# Altium schematic sheet power_mgmt.SchDoc (part 1 of 2)
size A4; SheetNumber: 6; SheetTotal: 8
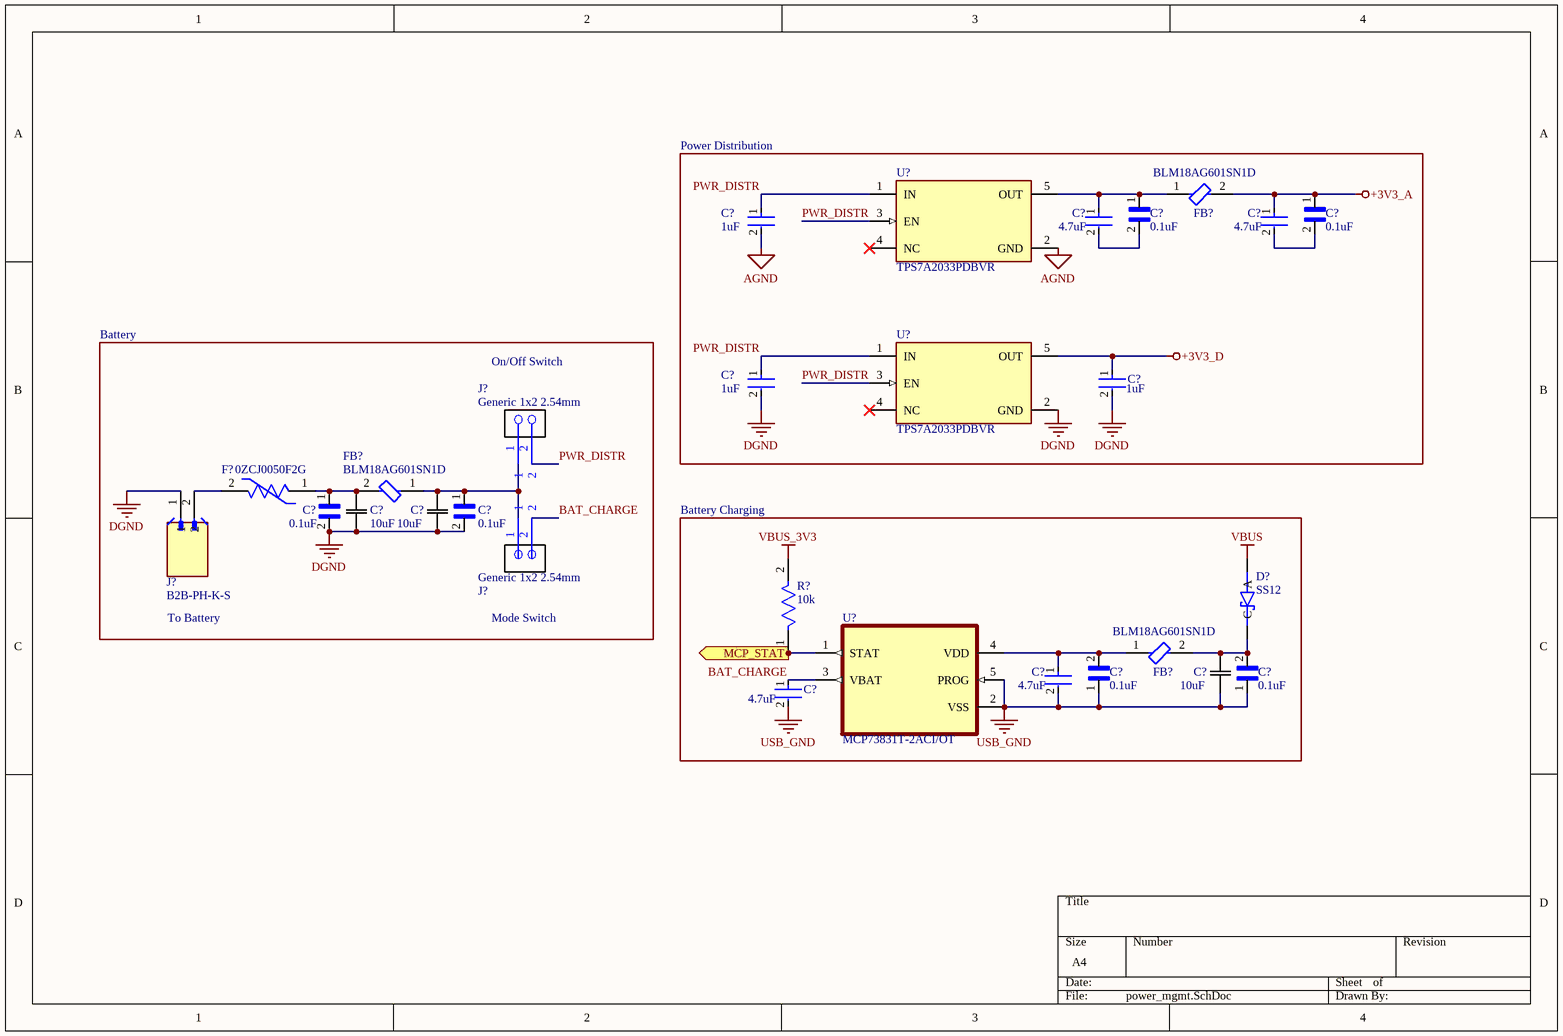
[diagram p0: power_mgmt.SchDoc]

## Parts
(Parts that share a designator on the sheet are numbered #1, #2 ... from top to bottom, then left to right.)
C?#1  1uF  [CC0805KKX7R7BB106]
C?#2  4.7uF  [CC0805KKX7R7BB106]
C?#3  4.7uF  [CC0805KKX7R7BB106]
C?#4  0.1uF  [CC0603JRX7R8BB104]
C?#5  0.1uF  [CC0603JRX7R8BB104]
C?#6  1uF  [CC0805KKX7R7BB106]
C?#7  1uF  [CC0805KKX7R7BB106]
C?#8  0.1uF  [CC0603JRX7R8BB104]
C?#9  0.1uF  [CC0603JRX7R8BB104]
C?#10  10uF  [CC0805KKX7R7BB106]
C?#11  10uF  [CC0805KKX7R7BB106]
C?#12  10uF  [CC0805KKX7R7BB106]
C?#13  4.7uF  [CC0805KKX7R7BB106]
C?#14  0.1uF  [CC0603JRX7R8BB104]
C?#15  0.1uF  [CC0603JRX7R8BB104]
C?#16  4.7uF  [CC0805KKX7R7BB106]
D?  SS12  [DIOM4427X270N]
F?  0ZCJ0050F2G  [0ZCJ0050FF2G]
FB?#1  BLM18AG601SN1D  [BLM18AG601SN1D]
FB?#2  BLM18AG601SN1D  [BLM18AG601SN1D]
FB?#3  BLM18AG601SN1D  [BLM18AG601SN1D]
J?#1  Generic 1x2 2.54mm  [GENERIC 1X2 2.54mm]
J?#2  B2B-PH-K-S  [JST_B2B-PH-K-S]
J?#3  Generic 1x2 2.54mm  [GENERIC 1X2 2.54mm]
R?  10k  [RC0603FR-07]
U?#1  TPS7A2033PDBVR  [TPS7A2033PDBVR]
U?#2  TPS7A2033PDBVR  [TPS7A2033PDBVR]
U?#3  MCP73831T-2ACI/OT  [SOT95P280X145-5N]

## Blocks framed on the sheet
Power Distribution: C?#1-C?#7 FB?#1 U?#1 U?#2
Battery Charging: C?#12-C?#16 D? FB?#3 R? U?#3

## Ports
MCP_STAT (out)

## Nets
+3V3_A: C?#3.1 C?#5.1 FB?#1.2
+3V3_D: C?#7.1 U?#2.5(OUT)
AGND: C?#1.2 U?#1.2(GND)
DGND: C?#6.2 C?#7.2 C?#8.2 C?#9.2 C?#10.1 C?#11.1 J?#2.1 U?#2.2(GND)
USB_GND: C?#12.2 C?#13.2 C?#14.1 C?#15.1 C?#16.2 U?#3.2(VSS) U?#3.5(PROG)
VBUS: D?.A
VBUS_3V3: R?.2
BAT_CHARGE: C?#16.1 U?#3.3(VBAT)
MCP_STAT: R?.1 U?#3.1(STAT) ; port MCP_STAT
PWR_DISTR: C?#1.1 C?#6.1 U?#1.1(IN) U?#1.3(EN) U?#2.1(IN) U?#2.3(EN)
NetC?#2_1: C?#2.1 C?#4.1 FB?#1.1 U?#1.5(OUT)
NetC?#2_2: C?#2.2 C?#4.2
NetC?#3_2: C?#3.2 C?#5.2
NetC?#8_1: C?#8.1 C?#10.2 F?.1 FB?#2.2
NetC?#9_1: C?#9.1 C?#11.2 FB?#2.1
NetC?#12_1: C?#12.1 C?#15.2 D?.C FB?#3.2
NetC?#13_1: C?#13.1 C?#14.2 FB?#3.1 U?#3.4(VDD)
NetF?_2: F?.2 J?#2.2

Not connected (* = marked no-connect by the designer): J?#1 1 2; J?#3 1 2; U?#1 4(NC)*; U?#2 4(NC)*

## Notes on the sheet
- Battery
- On/Off Switch
- To Battery
- Mode Switch
## Library data of the parts
C?#1 C?#6 C?#7 = CC0805KKX7R7BB105: 16V 1uF X7R ±10% 0805 Multilayer Ceramic Capacitors MLCC - SMD/SMT ROHS; Manufacturer: Yageo Group; Manufacturer Package Identifier: CC0805-0.85; Value: 1µF; Supplier: DigiKey; Supplier Part Number: 311-1365-1-ND; Manufacturer Part Number: CC0805KKX7R7BB105; RoHS: Compliant; Category: Ceramic Capacitors; Stock: 898629; Pricing: 1=0.13, 10=0.072, 50=0.05, 100=0.0434, 500=0.0323, 1000=0.02889 (USD); Case/Package: 0805; Case Code (Imperial): 0805; Case Code (Metric): 2012; China RoHS: Compliant; Country of Origin: Mainland China, Taiwan; Depth: 1.25mm; Dielectric: X7R; Dielectric Material: Ceramic; Export Control Classification Number (ECCN) Code: EAR99; Halogen Free: Halogen Free; Height: 1.25mm; Harmonized Tariff Schedule (HTS) Code: 8532.24.00.20; Introduction Date: 2009-04-17; Lead Free: Lead Free; Length: 2mm; Lifecycle Status: Production; Material: Ceramic; Max Operating Temperature: 125°C; Min Operating Temperature: -55°C; Mounting Technology: Surface Mount; Pins: 2; Number of Terminals: 2; Radiation Hardening: No; REACH SVHC: Yes; Schedule B: 8532240020, 8532240020|8532240020|8532240020|8532240020|8532240020|8532240020|8532240020|8532240020|8532240020|8532240020|8532240020|8532240020, 8532240020|8532240020|8532240020|8532240020|8532240020|8532240020|8532240020|8532240020|8532240020|8532240020|8532240020|8532240020|8532240020, 8532240020|8532240020|8532240020|8532240020|8532240020|8532240020|8532240020|8532240020|8532240020|8532240020|8532240020|8532240020|8532240020|8532240020; Termination: SMD/SMT; Thickness: 1.2446mm; Tolerance: 10%; Voltage Rating: 16V; Voltage Rating (DC): 16V; Width: 1.25mm; ComponentLink1URL: https://datasheet.octopart.com:443/CC0805KKX7R7BB105-Yageo-datasheet-177165144.pdf?src-supplier=IHS; ComponentLink1Description: https://datasheet.octopart.com:443/CC0805KKX7R7BB105-Yageo-datasheet-177165144.pdf?src-supplier=IHS; ComponentLink2URL: https://datasheet.octopart.com:443/CC0805KKX7R7BB105-Yageo-datasheet-78855689.pdf?src-supplier=Upverter; ComponentLink2Description: https://datasheet.octopart.com:443/CC0805KKX7R7BB105-Yageo-datasheet-78855689.pdf?src-supplier=Upverter; ComponentLink3URL: https://datasheet.octopart.com:443/CC0805KKX7R7BB105-Yageo-Group-datasheet-189192896.pdf?src-supplier=Future+Electronics; ComponentLink3Description: https://datasheet.octopart.com:443/CC0805KKX7R7BB105-Yageo-Group-datasheet-189192896.pdf?src-supplier=Future+Electronics; ComponentLink4URL: https://datasheet.octopart.com:443/CC0805KKX7R7BB105-Yageo-datasheet-166511530.pdf?src-supplier=Future+Electronics; ComponentLink4Description: https://datasheet.octopart.com:443/CC0805KKX7R7BB105-Yageo-datasheet-166511530.pdf?src-supplier=Future+Electronics; ComponentLink5URL: https://datasheet.octopart.com:443/CC0805KKX7R7BB105-Yageo-datasheet-137700082.pdf?src-supplier=Future+Electronics; ComponentLink5Description: https://datasheet.octopart.com:443/CC0805KKX7R7BB105-Yageo-datasheet-137700082.pdf?src-supplier=Future+Electronics; ComponentLink6URL: https://datasheet.octopart.com:443/CC0805KKX7R7BB105-Yageo-datasheet-137700084.pdf?src-supplier=Future+Electronics; ComponentLink6Description: https://datasheet.octopart.com:443/CC0805KKX7R7BB105-Yageo-datasheet-137700084.pdf?src-supplier=Future+Electronics; ComponentLink7URL: https://datasheet.octopart.com:443/CC0805KKX7R7BB105-Yageo-datasheet-27626582.pdf?src-supplier=Future+Electronics; ComponentLink7Description: https://datasheet.octopart.com:443/CC0805KKX7R7BB105-Yageo-datasheet-27626582.pdf?src-supplier=Future+Electronics; ComponentLink8URL: https://datasheet.octopart.com:443/CC0805KKX7R7BB105-Yageo-datasheet-15895757.pdf?src-supplier=Future+Electronics; ComponentLink8Description: https://datasheet.octopart.com:443/CC0805KKX7R7BB105-Yageo-datasheet-15895757.pdf?src-supplier=Future+Electronics; ComponentLink9URL: https://datasheet.octopart.com:443/CC0805KKX7R7BB105-Yageo-datasheet-12526321.pdf?src-supplier=Future+Electronics; ComponentLink9Description: https://datasheet.octopart.com:443/CC0805KKX7R7BB105-Yageo-datasheet-12526321.pdf?src-supplier=Future+Electronics; ComponentLink10URL: https://datasheet.octopart.com:443/CC0805KKX7R7BB105-Yageo-datasheet-10911834.pdf?src-supplier=Future+Electronics; ComponentLink10Description: https://datasheet.octopart.com:443/CC0805KKX7R7BB105-Yageo-datasheet-10911834.pdf?src-supplier=Future+Electronics; ComponentLink11URL: https://datasheet.octopart.com:443/CC0805KKX7R7BB105-Yageo-datasheet-8324442.pdf?src-supplier=Future+Electronics; ComponentLink11Description: https://datasheet.octopart.com:443/CC0805KKX7R7BB105-Yageo-datasheet-8324442.pdf?src-supplier=Future+Electronics; ComponentLink12URL: https://datasheet.octopart.com/CC0805KKX7R7BB105-Yageo-datasheet-10883670.pdf; ComponentLink12Description: https://datasheet.octopart.com/CC0805KKX7R7BB105-Yageo-datasheet-10883670.pdf; ComponentLink13URL: https://datasheet.octopart.com:443/CC0805KKX7R7BB105-Yageo-datasheet-140260305.pdf?src-supplier=SOS+electronic; ComponentLink13Description: https://datasheet.octopart.com:443/CC0805KKX7R7BB105-Yageo-datasheet-140260305.pdf?src-supplier=SOS+electronic; ComponentLink14URL: https://datasheet.octopart.com:443/CC0805KKX7R7BB105-Yageo-datasheet-147453679.pdf?src-supplier=Farnell; ComponentLink14Description: https://datasheet.octopart.com:443/CC0805KKX7R7BB105-Yageo-datasheet-147453679.pdf?src-supplier=Farnell; ComponentLink15URL: https://datasheet.octopart.com:443/CC0805KKX7R7BB105-Yageo-datasheet-181969634.pdf?src-supplier=Farnell; ComponentLink15Description: https://datasheet.octopart.com:443/CC0805KKX7R7BB105-Yageo-datasheet-181969634.pdf?src-supplier=Farnell; ComponentLink16URL: https://datasheet.octopart.com:443/CC0805KKX7R7BB105-Yageo-datasheet-62336348.pdf?src-supplier=element14+APAC; ComponentLink16Description: https://datasheet.octopart.com:443/CC0805KKX7R7BB105-Yageo-datasheet-62336348.pdf?src-supplier=element14+APAC; ComponentLink17URL: https://datasheet.octopart.com:443/CC0805KKX7R7BB105-Yageo-Group-datasheet-165992755.pdf?src-supplier=ODG+(Origin+Data+Global); ComponentLink17Description: https://datasheet.octopart.com:443/CC0805KKX7R7BB105-Yageo-Group-datasheet-165992755.pdf?src-supplier=ODG+(Origin+Data+Global); ComponentLink18URL: https://datasheet.octopart.com:443/CC0805KKX7R7BB105-Yageo-datasheet-151948686.pdf?src-supplier=TME; ComponentLink18Description: https://datasheet.octopart.com:443/CC0805KKX7R7BB105-Yageo-datasheet-151948686.pdf?src-supplier=TME; ComponentLink19URL: https://datasheet.octopart.com:443/CC0805KKX7R7BB105-Yageo-datasheet-8324192.pdf?src-supplier=TME; ComponentLink19Description: https://datasheet.octopart.com:443/CC0805KKX7R7BB105-Yageo-datasheet-8324192.pdf?src-supplier=TME; ComponentLink20URL: https://datasheet.octopart.com:443/CC0805KKX7R7BB105-Yageo-datasheet-120101875.pdf?src-supplier=Megastar; ComponentLink20Description: https://datasheet.octopart.com:443/CC0805KKX7R7BB105-Yageo-datasheet-120101875.pdf?src-supplier=Megastar; ComponentLink21URL: https://datasheet.octopart.com:443/CC0805KKX7R7BB105-Yageo-datasheet-8701427.pdf?src-supplier=element14; ComponentLink21Description: https://datasheet.octopart.com:443/CC0805KKX7R7BB105-Yageo-datasheet-8701427.pdf?src-supplier=element14; ComponentLink22URL: https://datasheet.octopart.com:443/CC0805KKX7R7BB105-Yageo-datasheet-499490.pdf?src-supplier=element14; ComponentLink22Description: https://datasheet.octopart.com:443/CC0805KKX7R7BB105-Yageo-datasheet-499490.pdf?src-supplier=element14; ComponentLink23URL: https://datasheet.octopart.com:443/CC0805KKX7R7BB105-Yageo-datasheet-5301394.pdf?src-supplier=element14; ComponentLink23Description: https://datasheet.octopart.com:443/CC0805KKX7R7BB105-Yageo-datasheet-5301394.pdf?src-supplier=element14; ComponentLink24URL: http://sigma.octopart.com:80/conflict_mineral_statement/Yageo-company-3.pdf?src-supplier=Compliance+Statements; ComponentLink24Description: http://sigma.octopart.com:80/conflict_mineral_statement/Yageo-company-3.pdf?src-supplier=Compliance+Statements; ComponentLink25URL: http://sigma.octopart.com:80/rohs_statement/Yageo-company-2.pdf?src-supplier=Compliance+Statements; ComponentLink25Description: http://sigma.octopart.com:80/rohs_statement/Yageo-company-2.pdf?src-supplier=Compliance+Statements; Supplier 1: DigiKey; Supplier Part Number 1: 311-1365-1-ND
C?#2 C?#3 C?#13 C?#16 = CC0805KKX7R7BB475: 16V 4.7uF X7R ±10% 0805 Multilayer Ceramic Capacitors MLCC - SMD/SMT ROHS; Manufacturer: Yageo Group; Manufacturer Package Identifier: CC0805-0.85; Value: 4.7µF; Supplier: DigiKey; Supplier Part Number: 311-1883-1-ND; Manufacturer Part Number: CC0805KKX7R7BB475; RoHS: Compliant; Category: Ceramic Capacitors; Stock: 16960; Pricing: 1=0.38, 10=0.224, 50=0.1656, 100=0.1475, 500=0.11696, 1000=0.10755 (USD); Case/Package: 0805; Case Code (Imperial): 0805; Case Code (Metric): 2012; China RoHS: Compliant; Composition: Ceramic; Dielectric: X7R; Dielectric Material: Ceramic; Halogen Free: Halogen Free; Height: 1.25mm; Lead Free: Lead Free; Length: 2mm; Lifecycle Status: Production; Material: Ceramic; Max Operating Temperature: 125°C; Min Operating Temperature: -55°C; Mounting Technology: Surface Mount; Number of Terminals: 2; Packaging: Tape & Reel (TR); REACH SVHC: Yes; Schedule B: 8532240020, 8532240020|8532240020, 8532240020|8532240020|8532240020, 8532240020|8532240020|8532240020|8532240020; Termination: SMD/SMT; Thickness: 1.4478mm; Tolerance: 10%; Voltage Rating: 16V; Voltage Rating (DC): 16V; Weight: 5.499807mg; Width: 1.25mm; ComponentLink1URL: https://datasheet.octopart.com:443/CC0805KKX7R7BB475-Yageo-datasheet-177165144.pdf?src-supplier=IHS; ComponentLink1Description: https://datasheet.octopart.com:443/CC0805KKX7R7BB475-Yageo-datasheet-177165144.pdf?src-supplier=IHS; ComponentLink2URL: https://datasheet.octopart.com:443/CC0805KKX7R7BB475-Yageo-datasheet-78855689.pdf?src-supplier=Upverter; ComponentLink2Description: https://datasheet.octopart.com:443/CC0805KKX7R7BB475-Yageo-datasheet-78855689.pdf?src-supplier=Upverter; ComponentLink3URL: https://datasheet.octopart.com:443/CC0805KKX7R7BB475-Yageo-datasheet-181969646.pdf?src-supplier=Newark; ComponentLink3Description: https://datasheet.octopart.com:443/CC0805KKX7R7BB475-Yageo-datasheet-181969646.pdf?src-supplier=Newark; ComponentLink4URL: https://datasheet.octopart.com:443/CC0805KKX7R7BB475-Yageo-datasheet-181969644.pdf?src-supplier=Newark; ComponentLink4Description: https://datasheet.octopart.com:443/CC0805KKX7R7BB475-Yageo-datasheet-181969644.pdf?src-supplier=Newark; ComponentLink5URL: https://datasheet.octopart.com:443/CC0805KKX7R7BB475-Yageo-datasheet-140260305.pdf?src-supplier=Newark; ComponentLink5Description: https://datasheet.octopart.com:443/CC0805KKX7R7BB475-Yageo-datasheet-140260305.pdf?src-supplier=Newark; ComponentLink6URL: https://datasheet.octopart.com:443/CC0805KKX7R7BB475-Yageo-datasheet-147453679.pdf?src-supplier=Newark; ComponentLink6Description: https://datasheet.octopart.com:443/CC0805KKX7R7BB475-Yageo-datasheet-147453679.pdf?src-supplier=Newark; ComponentLink7URL: https://datasheet.octopart.com:443/CC0805KKX7R7BB475-Yageo-Group-datasheet-188689702.pdf?src-supplier=Farnell; ComponentLink7Description: https://datasheet.octopart.com:443/CC0805KKX7R7BB475-Yageo-Group-datasheet-188689702.pdf?src-supplier=Farnell; ComponentLink8URL: https://datasheet.octopart.com:443/CC0805KKX7R7BB475-Yageo-datasheet-166511530.pdf?src-supplier=Future+Electronics; ComponentLink8Description: https://datasheet.octopart.com:443/CC0805KKX7R7BB475-Yageo-datasheet-166511530.pdf?src-supplier=Future+Electronics; ComponentLink9URL: https://datasheet.octopart.com:443/CC0805KKX7R7BB475-Yageo-datasheet-137700082.pdf?src-supplier=Future+Electronics; ComponentLink9Description: https://datasheet.octopart.com:443/CC0805KKX7R7BB475-Yageo-datasheet-137700082.pdf?src-supplier=Future+Electronics; ComponentLink10URL: https://datasheet.octopart.com:443/CC0805KKX7R7BB475-Yageo-datasheet-27626582.pdf?src-supplier=Future+Electronics; ComponentLink10Description: https://datasheet.octopart.com:443/CC0805KKX7R7BB475-Yageo-datasheet-27626582.pdf?src-supplier=Future+Electronics; ComponentLink11URL: https://datasheet.octopart.com:443/CC0805KKX7R7BB475-Yageo-Group-datasheet-165992755.pdf?src-supplier=ODG+(Origin+Data+Global); ComponentLink11Description: https://datasheet.octopart.com:443/CC0805KKX7R7BB475-Yageo-Group-datasheet-165992755.pdf?src-supplier=ODG+(Origin+Data+Global); ComponentLink12URL: https://datasheet.octopart.com:443/CC0805KKX7R7BB475-Yageo-datasheet-151948686.pdf?src-supplier=TME; ComponentLink12Description: https://datasheet.octopart.com:443/CC0805KKX7R7BB475-Yageo-datasheet-151948686.pdf?src-supplier=TME; ComponentLink13URL: https://datasheet.octopart.com/Surface-Mount-Ceramic-Multilayer-Capacitors%3B-General-Purpose-%26-High-Capacitance-Class-2%2C-X7R-Yageo-datasheet-family-114.pdf; ComponentLink13Description: https://datasheet.octopart.com/Surface-Mount-Ceramic-Multilayer-Capacitors%3B-General-Purpose-%26-High-Capacitance-Class-2%2C-X7R-Yageo-datasheet-family-114.pdf; ComponentLink14URL: https://datasheet.octopart.com/CC0805KKX7R7BB475-Yageo-datasheet-10883670.pdf; ComponentLink14Description: https://datasheet.octopart.com/CC0805KKX7R7BB475-Yageo-datasheet-10883670.pdf; ComponentLink15URL: http://sigma.octopart.com:80/rohs_statement/Surface-Mount-Ceramic-Multilayer-Capacitors%3B-General-Purpose-%26-High-Capacitance-Class-2%2C-X7R-Yageo-family-124.pdf?src-supplier=Compliance+Statements; ComponentLink15Description: http://sigma.octopart.com:80/rohs_statement/Surface-Mount-Ceramic-Multilayer-Capacitors%3B-General-Purpose-%26-High-Capacitance-Class-2%2C-X7R-Yageo-family-124.pdf?src-supplier=Compliance+Statements; ComponentLink16URL: http://sigma.octopart.com:80/reach_statement/Surface-Mount-Ceramic-Multilayer-Capacitors%3B-General-Purpose-%26-High-Capacitance-Class-2%2C-X7R-Yageo-family-125.pdf?src-supplier=Compliance+Statements; ComponentLink16Description: http://sigma.octopart.com:80/reach_statement/Surface-Mount-Ceramic-Multilayer-Capacitors%3B-General-Purpose-%26-High-Capacitance-Class-2%2C-X7R-Yageo-family-125.pdf?src-supplier=Compliance+Statements; ComponentLink17URL: http://sigma.octopart.com:80/conflict_mineral_statement/Yageo-company-3.pdf?src-supplier=Compliance+Statements; ComponentLink17Description: http://sigma.octopart.com:80/conflict_mineral_statement/Yageo-company-3.pdf?src-supplier=Compliance+Statements; ComponentLink18URL: http://sigma.octopart.com:80/rohs_statement/Yageo-company-2.pdf?src-supplier=Compliance+Statements; ComponentLink18Description: http://sigma.octopart.com:80/rohs_statement/Yageo-company-2.pdf?src-supplier=Compliance+Statements; Supplier 1: DigiKey; Supplier Part Number 1: 311-1883-6-ND
C?#4 C?#5 C?#8 C?#9 C?#14 C?#15 = CC0603JRX7R8BB104: 25V 100nF X7R ±5% 0603 Multilayer Ceramic Capacitors MLCC - SMD/SMT ROHS; Manufacturer: Yageo Group; Supplier: DigiKey; Supplier Part Number: 311-1777-1-ND; Manufacturer Part Number: CC0603JRX7R8BB104; RoHS: Compliant; Category: Ceramic Capacitors; Stock: 156739; Pricing: 1=0.1, 10=0.056, 50=0.0386, 100=0.0333, 500=0.02444, 1000=0.02172 (USD); Value: 100nF; Case/Package: 0603; Case Code (Imperial): 0603; Case Code (Metric): 1608; China RoHS: Compliant; Composition: Ceramic; Depth: 800µm; Dielectric: X7R; Dielectric Material: Ceramic; Halogen Free: Halogen Free; Height: 800µm; Lead Free: Lead Free; Length: 1.6mm; Lifecycle Status: Production; Max Operating Temperature: 125°C; Min Operating Temperature: -55°C; Mounting Technology: Surface Mount; Number of Terminals: 2; Radiation Hardening: No; REACH SVHC: Yes; Schedule B: 8532240020, 8532240020|8532240020, 8532240020|8532240020|8532240020, 8532240020|8532240020|8532240020|8532240020; Termination: SMD/SMT; Thickness: 889µm; Tolerance: 5%; Voltage Rating: 25V; Voltage Rating (DC): 25V; Weight: 2.012816mg; Width: 800µm; ComponentLink1URL: https://datasheet.octopart.com:443/CC0603JRX7R8BB104-Yageo-datasheet-177165144.pdf?src-supplier=IHS; ComponentLink1Description: https://datasheet.octopart.com:443/CC0603JRX7R8BB104-Yageo-datasheet-177165144.pdf?src-supplier=IHS; ComponentLink2URL: https://datasheet.octopart.com:443/CC0603JRX7R8BB104-Yageo-datasheet-147453679.pdf?src-supplier=Farnell; ComponentLink2Description: https://datasheet.octopart.com:443/CC0603JRX7R8BB104-Yageo-datasheet-147453679.pdf?src-supplier=Farnell; ComponentLink3URL: https://datasheet.octopart.com:443/CC0603JRX7R8BB104-Yageo-datasheet-181968346.pdf?src-supplier=Farnell; ComponentLink3Description: https://datasheet.octopart.com:443/CC0603JRX7R8BB104-Yageo-datasheet-181968346.pdf?src-supplier=Farnell; ComponentLink4URL: https://datasheet.octopart.com:443/CC0603JRX7R8BB104-Yageo-datasheet-151948686.pdf?src-supplier=TME; ComponentLink4Description: https://datasheet.octopart.com:443/CC0603JRX7R8BB104-Yageo-datasheet-151948686.pdf?src-supplier=TME; ComponentLink5URL: https://datasheet.octopart.com/CC0603JRX7R8BB104-Yageo-datasheet-12526321.pdf; ComponentLink5Description: https://datasheet.octopart.com/CC0603JRX7R8BB104-Yageo-datasheet-12526321.pdf; ComponentLink6URL: https://datasheet.octopart.com/CC0603JRX7R8BB104-Yageo-datasheet-10883670.pdf; ComponentLink6Description: https://datasheet.octopart.com/CC0603JRX7R8BB104-Yageo-datasheet-10883670.pdf; ComponentLink7URL: https://datasheet.octopart.com:443/CC0603JRX7R8BB104-Yageo-datasheet-166511530.pdf?src-supplier=Future+Electronics; ComponentLink7Description: https://datasheet.octopart.com:443/CC0603JRX7R8BB104-Yageo-datasheet-166511530.pdf?src-supplier=Future+Electronics; ComponentLink8URL: https://datasheet.octopart.com:443/CC0603JRX7R8BB104-Yageo-datasheet-137700082.pdf?src-supplier=Future+Electronics; ComponentLink8Description: https://datasheet.octopart.com:443/CC0603JRX7R8BB104-Yageo-datasheet-137700082.pdf?src-supplier=Future+Electronics; ComponentLink9URL: https://datasheet.octopart.com:443/CC0603JRX7R8BB104-Yageo-datasheet-137700084.pdf?src-supplier=Future+Electronics; ComponentLink9Description: https://datasheet.octopart.com:443/CC0603JRX7R8BB104-Yageo-datasheet-137700084.pdf?src-supplier=Future+Electronics; ComponentLink10URL: https://datasheet.octopart.com:443/CC0603JRX7R8BB104-Yageo-datasheet-27626582.pdf?src-supplier=Future+Electronics; ComponentLink10Description: https://datasheet.octopart.com:443/CC0603JRX7R8BB104-Yageo-datasheet-27626582.pdf?src-supplier=Future+Electronics; ComponentLink11URL: https://datasheet.octopart.com:443/CC0603JRX7R8BB104-Yageo-datasheet-15895757.pdf?src-supplier=Future+Electronics; ComponentLink11Description: https://datasheet.octopart.com:443/CC0603JRX7R8BB104-Yageo-datasheet-15895757.pdf?src-supplier=Future+Electronics; ComponentLink12URL: https://datasheet.octopart.com:443/CC0603JRX7R8BB104-Yageo-datasheet-10911834.pdf?src-supplier=Future+Electronics; ComponentLink12Description: https://datasheet.octopart.com:443/CC0603JRX7R8BB104-Yageo-datasheet-10911834.pdf?src-supplier=Future+Electronics; ComponentLink13URL: https://datasheet.octopart.com:443/CC0603JRX7R8BB104-Yageo-datasheet-8324442.pdf?src-supplier=Future+Electronics; ComponentLink13Description: https://datasheet.octopart.com:443/CC0603JRX7R8BB104-Yageo-datasheet-8324442.pdf?src-supplier=Future+Electronics; ComponentLink14URL: https://datasheet.octopart.com:443/CC0603JRX7R8BB104-Yageo-Group-datasheet-165992755.pdf?src-supplier=ODG+(Origin+Data+Global); ComponentLink14Description: https://datasheet.octopart.com:443/CC0603JRX7R8BB104-Yageo-Group-datasheet-165992755.pdf?src-supplier=ODG+(Origin+Data+Global); ComponentLink15URL: http://sigma.octopart.com:80/rohs_statement/Surface-Mount-Ceramic-Multilayer-Capacitors%3B-General-Purpose-%26-High-Capacitance-Class-2%2C-X7R-Yageo-family-124.pdf?src-supplier=Compliance+Statements; ComponentLink15Description: http://sigma.octopart.com:80/rohs_statement/Surface-Mount-Ceramic-Multilayer-Capacitors%3B-General-Purpose-%26-High-Capacitance-Class-2%2C-X7R-Yageo-family-124.pdf?src-supplier=Compliance+Statements; ComponentLink16URL: http://sigma.octopart.com:80/reach_statement/Surface-Mount-Ceramic-Multilayer-Capacitors%3B-General-Purpose-%26-High-Capacitance-Class-2%2C-X7R-Yageo-family-125.pdf?src-supplier=Compliance+Statements; ComponentLink16Description: http://sigma.octopart.com:80/reach_statement/Surface-Mount-Ceramic-Multilayer-Capacitors%3B-General-Purpose-%26-High-Capacitance-Class-2%2C-X7R-Yageo-family-125.pdf?src-supplier=Compliance+Statements; ComponentLink17URL: http://sigma.octopart.com:80/conflict_mineral_statement/Yageo-company-3.pdf?src-supplier=Compliance+Statements; ComponentLink17Description: http://sigma.octopart.com:80/conflict_mineral_statement/Yageo-company-3.pdf?src-supplier=Compliance+Statements; ComponentLink18URL: http://sigma.octopart.com:80/rohs_statement/Yageo-company-2.pdf?src-supplier=Compliance+Statements; ComponentLink18Description: http://sigma.octopart.com:80/rohs_statement/Yageo-company-2.pdf?src-supplier=Compliance+Statements; Supplier 1: DigiKey; Supplier Part Number 1: 311-1777-1-ND
C?#10-C?#12 = CC0805KKX7R7BB106: 16V 10uF X7R ±10% 0805 Multilayer Ceramic Capacitors MLCC - SMD/SMT ROHS; Manufacturer: Yageo Group; Value: 10µF; Supplier: DigiKey; Supplier Part Number: 311-3501-1-ND; Manufacturer Part Number: CC0805KKX7R7BB106; RoHS: Compliant; Category: Ceramic Capacitors; Stock: 2785; Pricing: 1=0.54, 10=0.329, 50=0.2472, 100=0.2222, 500=0.17992, 1000=0.16687 (USD); Case/Package: 0805; China RoHS: Compliant; Country of Origin: Mainland China, Taiwan; Dielectric: X7R; Dielectric Material: Ceramic; Export Control Classification Number (ECCN) Code: EAR99; Halogen Free: Halogen Free; Height: 1.25mm; Harmonized Tariff Schedule (HTS) Code: 8532.24.00.20; Introduction Date: 2013-05-20; Lead Free: Lead Free; Length: 2mm; Lifecycle Status: Production; Max Operating Temperature: 125°C; Min Operating Temperature: -55°C; Mounting Technology: Surface Mount; Number of Terminals: 2; REACH SVHC: Yes; Voltage Rating (DC): 16V; Width: 1.25mm; ComponentLink1URL: https://datasheet.octopart.com:443/CC0805KKX7R7BB106-Yageo-datasheet-177165144.pdf?src-supplier=IHS; ComponentLink1Description: https://datasheet.octopart.com:443/CC0805KKX7R7BB106-Yageo-datasheet-177165144.pdf?src-supplier=IHS; ComponentLink2URL: https://datasheet.octopart.com:443/CC0805KKX7R7BB106-Yageo-Group-datasheet-189192896.pdf?src-supplier=TME; ComponentLink2Description: https://datasheet.octopart.com:443/CC0805KKX7R7BB106-Yageo-Group-datasheet-189192896.pdf?src-supplier=TME; ComponentLink3URL: https://datasheet.octopart.com:443/CC0805KKX7R7BB106-Yageo-datasheet-147453679.pdf?src-supplier=Farnell; ComponentLink3Description: https://datasheet.octopart.com:443/CC0805KKX7R7BB106-Yageo-datasheet-147453679.pdf?src-supplier=Farnell; ComponentLink4URL: https://datasheet.octopart.com:443/CC0805KKX7R7BB106-Yageo-datasheet-181969636.pdf?src-supplier=Farnell; ComponentLink4Description: https://datasheet.octopart.com:443/CC0805KKX7R7BB106-Yageo-datasheet-181969636.pdf?src-supplier=Farnell; ComponentLink5URL: https://datasheet.octopart.com:443/CC0805KKX7R7BB106-Yageo-datasheet-151948686.pdf?src-supplier=Farnell; ComponentLink5Description: https://datasheet.octopart.com:443/CC0805KKX7R7BB106-Yageo-datasheet-151948686.pdf?src-supplier=Farnell; ComponentLink6URL: https://datasheet.octopart.com:443/CC0805KKX7R7BB106-Yageo-datasheet-166511530.pdf?src-supplier=Future+Electronics; ComponentLink6Description: https://datasheet.octopart.com:443/CC0805KKX7R7BB106-Yageo-datasheet-166511530.pdf?src-supplier=Future+Electronics; ComponentLink7URL: https://datasheet.octopart.com:443/CC0805KKX7R7BB106-Yageo-Group-datasheet-165992755.pdf?src-supplier=ODG+(Origin+Data+Global); ComponentLink7Description: https://datasheet.octopart.com:443/CC0805KKX7R7BB106-Yageo-Group-datasheet-165992755.pdf?src-supplier=ODG+(Origin+Data+Global); ComponentLink8URL: https://datasheet.octopart.com/CC0805KKX7R7BB106-Yageo-datasheet-10883670.pdf; ComponentLink8Description: https://datasheet.octopart.com/CC0805KKX7R7BB106-Yageo-datasheet-10883670.pdf; ComponentLink9URL: http://sigma.octopart.com:80/conflict_mineral_statement/Yageo-company-3.pdf?src-supplier=Compliance+Statements; ComponentLink9Description: http://sigma.octopart.com:80/conflict_mineral_statement/Yageo-company-3.pdf?src-supplier=Compliance+Statements; ComponentLink10URL: http://sigma.octopart.com:80/rohs_statement/Yageo-company-2.pdf?src-supplier=Compliance+Statements; ComponentLink10Description: http://sigma.octopart.com:80/rohs_statement/Yageo-company-2.pdf?src-supplier=Compliance+Statements; Supplier 1: DigiKey; Supplier Part Number 1: 311-3501-1-ND
D? = SS12: SS12 Series 500 mV 1 A 20 V Max Reverse Voltage Schottky Rectifier - DO-214AC; Manufacturer: onsemi; Manufacturer Lifecycle Status: ACTIVE; Average Rectified Current: 1A; Element Configuration: Single; Forward Voltage: 500mV; Max Forward Surge Current (Ifsm): 30A; Max Power Dissipation: 1.1W; Max Repetitive Reverse Voltage (Vrrm): 20V; Max Reverse Leakage Current: 200µA; Max Surge Current: 40A; Number of Elements: 1; Polarity: Standard; Supplier: DigiKey; Supplier Part Number: SS12FSCT-ND; Manufacturer Part Number: SS12; RoHS: Compliant; Category: Schottky Diodes; Stock: 25127; Pricing: 1=0.27, 10=0.224, 100=0.2087, 500=0.17638, 1000=0.16289, 2000=0.1513 (USD); China RoHS: Non-Compliant; Contact Plating: Tin; Country of Origin: Mainland China; Current Rating: 1A; Export Control Classification Number (ECCN) Code: EAR99; Forward Current: 1A; Height: 2.2mm; Harmonized Tariff Schedule (HTS) Code: 8541.10.00.80; Introduction Date: 1998-01-01; Lead Free: Lead Free; Length: 4.75mm; Lifecycle Status: Production; Max Operating Temperature: 125°C; Max Output current: 1A; Max Reverse Voltage (DC): 20V; Min Operating Temperature: -65°C; Mounting Technology: Surface Mount; Pins: 2; Number of Terminals: 2; Output Current: 1A; Peak Non-Repetitive Surge Current: 40A; Peak Reverse Current: 200µA; Power Dissipation: 1.1W; Radiation Hardening: No; REACH SVHC: No; Reverse Standoff Voltage: 20V; Schedule B: 8541100080, 8541100080|8541100080|8541100080|8541100080|8541100080; Termination: SMD/SMT; Voltage Rating (DC): 20V; Weight: 106mg; Width: 2.95mm; ComponentLink1URL: https://datasheet.octopart.com:443/SS12-onsemi-datasheet-180969535.pdf?src-supplier=IHS; ComponentLink1Description: https://datasheet.octopart.com:443/SS12-onsemi-datasheet-180969535.pdf?src-supplier=IHS; ComponentLink2URL: https://datasheet.octopart.com:443/SS12-Fairchild-Semiconductor-datasheet-37002494.pdf?src-supplier=IHS; ComponentLink2Description: https://datasheet.octopart.com:443/SS12-Fairchild-Semiconductor-datasheet-37002494.pdf?src-supplier=IHS; ComponentLink3URL: https://datasheet.octopart.com:443/SS12-ON-Semiconductor-datasheet-86698725.pdf?src-supplier=Upverter; ComponentLink3Description: https://datasheet.octopart.com:443/SS12-ON-Semiconductor-datasheet-86698725.pdf?src-supplier=Upverter; ComponentLink4URL: https://datasheet.octopart.com:443/SS12-onsemi-datasheet-3545.pdf?src-supplier=Fairchild+Semiconductor; ComponentLink4Description: https://datasheet.octopart.com:443/SS12-onsemi-datasheet-3545.pdf?src-supplier=Fairchild+Semiconductor; ComponentLink5URL: https://datasheet.octopart.com:443/SS12-ON-Semiconductor-datasheet-21199495.pdf?src-supplier=Fairchild+Semiconductor; ComponentLink5Description: https://datasheet.octopart.com:443/SS12-ON-Semiconductor-datasheet-21199495.pdf?src-supplier=Fairchild+Semiconductor; ComponentLink6URL: https://sigma.octopart.com:443/17345279/technical_drawing/Fairchild-Semiconductor-SS12.pdf?src-supplier=Fairchild+Semiconductor; ComponentLink6Description: https://sigma.octopart.com:443/17345279/technical_drawing/Fairchild-Semiconductor-SS12.pdf?src-supplier=Fairchild+Semiconductor; ComponentLink7URL: https://datasheet.octopart.com:443/SS12-ON-Semiconductor-datasheet-137256445.pdf?src-supplier=onsemi; ComponentLink7Description: https://datasheet.octopart.com:443/SS12-ON-Semiconductor-datasheet-137256445.pdf?src-supplier=onsemi; ComponentLink8URL: https://datasheet.octopart.com:443/SS12-ON-Semiconductor-datasheet-119409881.pdf?src-supplier=onsemi; ComponentLink8Description: https://datasheet.octopart.com:443/SS12-ON-Semiconductor-datasheet-119409881.pdf?src-supplier=onsemi; ComponentLink9URL: https://datasheet.octopart.com:443/SS12-ON-Semiconductor-datasheet-86698600.pdf?src-supplier=onsemi; ComponentLink9Description: https://datasheet.octopart.com:443/SS12-ON-Semiconductor-datasheet-86698600.pdf?src-supplier=onsemi; ComponentLink10URL: https://datasheet.octopart.com:443/SS12-ON-Semiconductor-datasheet-86693076.pdf?src-supplier=Farnell; ComponentLink10Description: https://datasheet.octopart.com:443/SS12-ON-Semiconductor-datasheet-86693076.pdf?src-supplier=Farnell; ComponentLink11URL: https://datasheet.octopart.com:443/SS12-Fairchild-Semiconductor-datasheet-16207783.pdf?src-supplier=Farnell; ComponentLink11Description: https://datasheet.octopart.com:443/SS12-Fairchild-Semiconductor-datasheet-16207783.pdf?src-supplier=Farnell; ComponentLink12URL: https://datasheet.octopart.com:443/SS12-ON-Semiconductor-datasheet-137710389.pdf?src-supplier=TME; ComponentLink12Description: https://datasheet.octopart.com:443/SS12-ON-Semiconductor-datasheet-137710389.pdf?src-supplier=TME; ComponentLink13URL: https://datasheet.octopart.com:443/SS12-Fairchild-Semiconductor-datasheet-14041508.pdf?src-supplier=iiiC; ComponentLink13Description: https://datasheet.octopart.com:443/SS12-Fairchild-Semiconductor-datasheet-14041508.pdf?src-supplier=iiiC; ComponentLink14URL: https://datasheet.octopart.com:443/SS12-Fairchild-Semiconductor-datasheet-67650223.pdf?src-supplier=Newark; ComponentLink14Description: https://datasheet.octopart.com:443/SS12-Fairchild-Semiconductor-datasheet-67650223.pdf?src-supplier=Newark; ComponentLink15URL: https://datasheet.octopart.com:443/SS12-Fairchild-Semiconductor-datasheet-68342034.pdf?src-supplier=element14+APAC; ComponentLink15Description: https://datasheet.octopart.com:443/SS12-Fairchild-Semiconductor-datasheet-68342034.pdf?src-supplier=element14+APAC; ComponentLink16URL: https://datasheet.octopart.com:443/SS12-Fairchild-Semiconductor-datasheet-77554681.pdf?src-supplier=element14+APAC; ComponentLink16Description: https://datasheet.octopart.com:443/SS12-Fairchild-Semiconductor-datasheet-77554681.pdf?src-supplier=element14+APAC; ComponentLink17URL: http://sigma.octopart.com:80/150631687/rohs_statement/ON-Semiconductor-SS12.pdf?src-supplier=Compliance+Statements; ComponentLink17Description: http://sigma.octopart.com:80/150631687/rohs_statement/ON-Semiconductor-SS12.pdf?src-supplier=Compliance+Statements; ComponentLink18URL: http://sigma.octopart.com:80/17357446/reach_statement/Fairchild-Semiconductor-SS12.pdf?src-supplier=Compliance+Statements; ComponentLink18Description: http://sigma.octopart.com:80/17357446/reach_statement/Fairchild-Semiconductor-SS12.pdf?src-supplier=Compliance+Statements; ComponentLink19URL: http://sigma.octopart.com:80/17357447/materials_sheet/Fairchild-Semiconductor-SS12.pdf?src-supplier=Compliance+Statements; ComponentLink19Description: http://sigma.octopart.com:80/17357447/materials_sheet/Fairchild-Semiconductor-SS12.pdf?src-supplier=Compliance+Statements; ComponentLink20URL: http://sigma.octopart.com:80/33331846/reach_statement/Fairchild-Semiconductor-SS12.pdf?src-supplier=Compliance+Statements; ComponentLink20Description: http://sigma.octopart.com:80/33331846/reach_statement/Fairchild-Semiconductor-SS12.pdf?src-supplier=Compliance+Statements; ComponentLink21URL: http://sigma.octopart.com:80/33331847/materials_sheet/Fairchild-Semiconductor-SS12.pdf?src-supplier=Compliance+Statements; ComponentLink21Description: http://sigma.octopart.com:80/33331847/materials_sheet/Fairchild-Semiconductor-SS12.pdf?src-supplier=Compliance+Statements; ComponentLink22URL: http://sigma.octopart.com:80/reach_statement/ON-Semiconductor-company-79.pdf?src-supplier=Compliance+Statements; ComponentLink22Description: http://sigma.octopart.com:80/reach_statement/ON-Semiconductor-company-79.pdf?src-supplier=Compliance+Statements; ComponentLink23URL: http://sigma.octopart.com:80/rohs_statement/Fairchild-Semiconductor-company-11.pdf?src-supplier=Compliance+Statements; ComponentLink23Description: http://sigma.octopart.com:80/rohs_statement/Fairchild-Semiconductor-company-11.pdf?src-supplier=Compliance+Statements; ComponentLink24URL: http://sigma.octopart.com:80/rohs_statement/Fairchild-Semiconductor-company-10.pdf?src-supplier=Compliance+Statements; ComponentLink24Description: http://sigma.octopart.com:80/rohs_statement/Fairchild-Semiconductor-company-10.pdf?src-supplier=Compliance+Statements; ComponentLink25URL: http://sigma.octopart.com:80/reach_statement/Fairchild-Semiconductor-company-9.pdf?src-supplier=Compliance+Statements; ComponentLink25Description: http://sigma.octopart.com:80/reach_statement/Fairchild-Semiconductor-company-9.pdf?src-supplier=Compliance+Statements; ComponentLink26URL: https://octopart.com:443/opatz8j6/c1?t=qGo5_zWIbhlt6we_BxCS9ytadW7EgnTyvC-fWZmq_57GYSacnbkVkxyM1T1Z7sP8Q-UGj9DbD7gKpaVd5xsJ7bB_Hzy0weBjoIEDUKxt8MUm-xM9xPTETOCObR3vG4-sZP5hO0RJ8jRqJJHzn24dObFqO3wm-L2M4GW0kKuGnsnP8VXyRvtU9uONK5RYEVr_Pa_RXiqoQPrTdifE_-xcD5V30zumkOpf9tT3BaBqJYxiU2xQPRtzAxplz19Nm-9gPmCIi37r60_rVVooFnx2UUfu8T7XPiDYTE5WzOAVUiBS5NdlifPe7LU8lJKmcIBBAnrS6WN4hv2uAs-2y_yXntJ9881Rluo&src-supplier=Compliance+Statements; ComponentLink26Description: https://octopart.com:443/opatz8j6/c1?t=qGo5_zWIbhlt6we_BxCS9ytadW7EgnTyvC-fWZmq_57GYSacnbkVkxyM1T1Z7sP8Q-UGj9DbD7gKpaVd5xsJ7bB_Hzy0weBjoIEDUKxt8MUm-xM9xPTETOCObR3vG4-sZP5hO0RJ8jRqJJHzn24dObFqO3wm-L2M4GW0kKuGnsnP8VXyRvtU9uONK5RYEVr_Pa_RXiqoQPrTdifE_-xcD5V30zumkOpf9tT3BaBqJYxiU2xQPRtzAxplz19Nm-9gPmCIi37r60_rVVooFnx2UUfu8T7XPiDYTE5WzOAVUiBS5NdlifPe7LU8lJKmcIBBAnrS6WN4hv2uAs-2y_yXntJ9881Rluo&src-supplier=Compliance+Statements; ComponentLink27URL: https://octopart.com:443/opatz8j6/c1?t=nMx2qt_Is3Em0hEEutSfdVknWRenjFKc8F_KtmXlUBpUKZRhiW2zcpoEM9Kk6GjnkNakVGMBDgVadhewlPlrgq39U48DkAQBmXD8W6iNWC0PaZVsOcdue5Ye4mhr0_-a2BtW_2pRsVZ2lXmGOAmHwsZHZoun66iC9EHMpnupWXOIoA9nh06L27XGYhtZuhB-6TNFQS791aTSGXm-Hv4KUZgnEvEYWNy5Bd4vO9fCeO4zUOu03sv_DZTeu1yv3QfZYpTREWDvhlB2mAsvQpL77-m3f3jroh_feQGmatPtiy9p3u_0yg7YVKOFe8PxafnbU04ucP4Rji9kLkpKCmjz8vBQPl4BFA&src-supplier=Compliance+Statements; ComponentLink27Description: https://octopart.com:443/opatz8j6/c1?t=nMx2qt_Is3Em0hEEutSfdVknWRenjFKc8F_KtmXlUBpUKZRhiW2zcpoEM9Kk6GjnkNakVGMBDgVadhewlPlrgq39U48DkAQBmXD8W6iNWC0PaZVsOcdue5Ye4mhr0_-a2BtW_2pRsVZ2lXmGOAmHwsZHZoun66iC9EHMpnupWXOIoA9nh06L27XGYhtZuhB-6TNFQS791aTSGXm-Hv4KUZgnEvEYWNy5Bd4vO9fCeO4zUOu03sv_DZTeu1yv3QfZYpTREWDvhlB2mAsvQpL77-m3f3jroh_feQGmatPtiy9p3u_0yg7YVKOFe8PxafnbU04ucP4Rji9kLkpKCmjz8vBQPl4BFA&src-supplier=Compliance+Statements; Supplier 1: DigiKey; Supplier Part Number 1: SS12FSCT-ND
F? = 0ZCJ0050FF2G: Resettable Fuse, PPTC, 1206 (3216 Metric), 0ZCJ Series, 8 VDC, 500 mA, 1 A, 0.1 s; Manufacturer: Bel Fuse; Current Rating: 100A; Hold Current: 500mA; Maximum Resistance 1 Hour (R1max): 700mΩ; Value: 150mΩ; Time to Trip: 100ms; Trip Current: 1A; Voltage Rating: 8V; Supplier: DigiKey; Supplier Part Number: 5923-0ZCJ0050FF2GCT-ND; Manufacturer Part Number: 0ZCJ0050FF2G; RoHS: Compliant; Category: PTC Resettable Fuses; Stock: 99354; Pricing: 1=0.2, 5=0.164, 10=0.151, 50=0.1252, 100=0.1155, 250=0.10384, 500=0.0958, 1000=0.08838 (USD); Case/Package: 1206; Case Code (Imperial): 1206; Case Code (Metric): 3216; China RoHS: Compliant; Contact Plating: Tin; Height: 550µm; Lead Free: Lead Free; Lifecycle Status: Production; Max Current Rating: 100A; Max Operating Temperature: 85°C; Min Operating Temperature: -40°C; Mounting Technology: Surface Mount; Number of Terminals: 2; Packaging: Tape & Reel (TR); REACH SVHC: Yes; Width: 1.8mm; Working Voltage: 8V; ComponentLink1URL: https://datasheet.octopart.com:443/0ZCJ0050FF2G-Bel-Fuse-datasheet-182141362.pdf?src-supplier=IHS; ComponentLink1Description: https://datasheet.octopart.com:443/0ZCJ0050FF2G-Bel-Fuse-datasheet-182141362.pdf?src-supplier=IHS; ComponentLink2URL: https://datasheet.octopart.com:443/0ZCJ0050FF2G-Bel-Fuse-datasheet-137696978.pdf?src-supplier=JRH+Electronics; ComponentLink2Description: https://datasheet.octopart.com:443/0ZCJ0050FF2G-Bel-Fuse-datasheet-137696978.pdf?src-supplier=JRH+Electronics; ComponentLink3URL: https://datasheet.octopart.com:443/0ZCJ0050FF2G-Bel-Fuse-datasheet-102831406.pdf?src-supplier=Sager+Electronics; ComponentLink3Description: https://datasheet.octopart.com:443/0ZCJ0050FF2G-Bel-Fuse-datasheet-102831406.pdf?src-supplier=Sager+Electronics; ComponentLink4URL: https://datasheet.octopart.com:443/0ZCJ0050FF2G-Bel-Fuse-datasheet-154728314.pdf?src-supplier=Electro+Sonic; ComponentLink4Description: https://datasheet.octopart.com:443/0ZCJ0050FF2G-Bel-Fuse-datasheet-154728314.pdf?src-supplier=Electro+Sonic; Supplier 1: DigiKey; Supplier Part Number 1: 5923-0ZCJ0050FF2GCT-ND
FB?#1-FB?#3 = BLM18AG601SN1D: Ferrite Beads Multi-Layer 600Ohm 25% 100MHz 500mA 380mOhm DCR 0603 Automotive Paper T/R; Manufacturer: Murata; DC Resistance (DCR): 380mΩ; Impedance: 600Ω; Material: Ferrite, Steel; Number of Circuits: 1; Value: 380mΩ; Shielding: Unshielded; Supplier: DigiKey; Supplier Part Number: 490-1014-1-ND; Manufacturer Part Number: BLM18AG601SN1D; RoHS: Compliant; Category: Ferrite Beads and Chips; Stock: 1054512; Pricing: 1=0.1, 10=0.057, 25=0.0496, 50=0.0446, 100=0.0401, 250=0.03456, 500=0.03076, 1000=0.02726 (USD); Case/Package: 0603; Case Code (Imperial): 0603; Case Code (Metric): 1608; Core Material: Ferrite; Country of Origin: Japan, Thailand; Current Rating: 500mA; DC Current: 500mA; Depth: 800µm; Export Control Classification Number (ECCN) Code: EAR99; Frequency: 100MHz; Height: 800µm; Harmonized Tariff Schedule (HTS) Code: 8504.50.80.00; Introduction Date: 2001-08-28; Lead Free: Lead Free; Length: 1.6mm; Lifecycle Status: Production; Max Current Rating: 500mA; Max DC Current: 500mA; Clock Frequency: 100MHz; Max Operating Temperature: 125°C; Military Standard: Not; Min Operating Temperature: -55°C; Number of Lines: 1; Pins: 2; Number of Terminals: 2; Packaging: Cut Tape; Radiation Hardening: No; REACH SVHC: Yes; RMS Current (Irms): 500mA; Schedule B: 8543706000, 8543706000|8543706000, 8543706000|8543706000|8543706000, 8543706000|8543706000|8543706000|8543706000; ESR: 380mΩ; Termination: SMD/SMT; Test Frequency: 100MHz; Tolerance: 25%; Weight: 2.012816mg; Width: 800µm; ComponentLink1URL: https://datasheet.octopart.com:443/BLM18AG601SN1D-Murata-datasheet-180806579.pdf?src-supplier=IHS; ComponentLink1Description: https://datasheet.octopart.com:443/BLM18AG601SN1D-Murata-datasheet-180806579.pdf?src-supplier=IHS; ComponentLink2URL: https://datasheet.octopart.com:443/BLM18AG601SN1D-Murata-datasheet-41195.pdf?src-supplier=Upverter; ComponentLink2Description: https://datasheet.octopart.com:443/BLM18AG601SN1D-Murata-datasheet-41195.pdf?src-supplier=Upverter; ComponentLink3URL: https://datasheet.octopart.com:443/BLM18AG601SN1D-Murata-datasheet-11743096.pdf?src-supplier=Newark; ComponentLink3Description: https://datasheet.octopart.com:443/BLM18AG601SN1D-Murata-datasheet-11743096.pdf?src-supplier=Newark; ComponentLink4URL: https://datasheet.octopart.com:443/BLM18AG601SN1D-Murata-datasheet-5338592.pdf?src-supplier=Newark; ComponentLink4Description: https://datasheet.octopart.com:443/BLM18AG601SN1D-Murata-datasheet-5338592.pdf?src-supplier=Newark; ComponentLink5URL: https://datasheet.octopart.com:443/BLM18AG601SN1D-Murata-datasheet-511221.pdf?src-supplier=TME; ComponentLink5Description: https://datasheet.octopart.com:443/BLM18AG601SN1D-Murata-datasheet-511221.pdf?src-supplier=TME; ComponentLink6URL: https://datasheet.octopart.com:443/BLM18AG601SN1D-Murata-datasheet-135086656.pdf?src-supplier=TME; ComponentLink6Description: https://datasheet.octopart.com:443/BLM18AG601SN1D-Murata-datasheet-135086656.pdf?src-supplier=TME; ComponentLink7URL: https://datasheet.octopart.com:443/BLM18AG601SN1D-Murata-datasheet-5396529.pdf?src-supplier=Factory+Futures; ComponentLink7Description: https://datasheet.octopart.com:443/BLM18AG601SN1D-Murata-datasheet-5396529.pdf?src-supplier=Factory+Futures; ComponentLink8URL: https://datasheet.octopart.com:443/BLM18AG601SN1D-Murata-datasheet-141257898.pdf?src-supplier=Ciiva; ComponentLink8Description: https://datasheet.octopart.com:443/BLM18AG601SN1D-Murata-datasheet-141257898.pdf?src-supplier=Ciiva; ComponentLink9URL: https://datasheet.octopart.com:443/BLM18AG601SN1D-Murata-datasheet-138706784.pdf?src-supplier=Ciiva; ComponentLink9Description: https://datasheet.octopart.com:443/BLM18AG601SN1D-Murata-datasheet-138706784.pdf?src-supplier=Ciiva; ComponentLink10URL: https://datasheet.octopart.com:443/BLM18AG601SN1D-Murata-datasheet-78375072.pdf?src-supplier=Future+Electronics; ComponentLink10Description: https://datasheet.octopart.com:443/BLM18AG601SN1D-Murata-datasheet-78375072.pdf?src-supplier=Future+Electronics; ComponentLink11URL: https://datasheet.octopart.com:443/BLM18AG601SN1D-Murata-datasheet-58177255.pdf?src-supplier=Future+Electronics; ComponentLink11Description: https://datasheet.octopart.com:443/BLM18AG601SN1D-Murata-datasheet-58177255.pdf?src-supplier=Future+Electronics; ComponentLink12URL: https://datasheet.octopart.com/BLM18AG601SN1D-Murata-datasheet-37129980.pdf; ComponentLink12Description: https://datasheet.octopart.com/BLM18AG601SN1D-Murata-datasheet-37129980.pdf; ComponentLink13URL: https://datasheet.octopart.com:443/BLM18AG601SN1D-Murata-datasheet-14066397.pdf?src-supplier=iiiC; ComponentLink13Description: https://datasheet.octopart.com:443/BLM18AG601SN1D-Murata-datasheet-14066397.pdf?src-supplier=iiiC; ComponentLink14URL: https://datasheet.octopart.com:443/BLM18AG601SN1D-Murata-datasheet-9604654.pdf?src-supplier=RS+(Formerly+Allied+Electronics); ComponentLink14Description: https://datasheet.octopart.com:443/BLM18AG601SN1D-Murata-datasheet-9604654.pdf?src-supplier=RS+(Formerly+Allied+Electronics); ComponentLink15URL: https://datasheet.octopart.com:443/BLM18AG601SN1D-Murata-datasheet-13143.pdf?src-supplier=RS+(Formerly+Allied+Electronics); ComponentLink15Description: https://datasheet.octopart.com:443/BLM18AG601SN1D-Murata-datasheet-13143.pdf?src-supplier=RS+(Formerly+Allied+Electronics); ComponentLink16URL: https://datasheet.octopart.com:443/BLM18AG601SN1D-Murata-datasheet-7628479.pdf?src-supplier=Jameco; ComponentLink16Description: https://datasheet.octopart.com:443/BLM18AG601SN1D-Murata-datasheet-7628479.pdf?src-supplier=Jameco; ComponentLink17URL: https://datasheet.octopart.com:443/BLM18AG601SN1D-Murata-datasheet-11030792.pdf?src-supplier=Farnell; ComponentLink17Description: https://datasheet.octopart.com:443/BLM18AG601SN1D-Murata-datasheet-11030792.pdf?src-supplier=Farnell; ComponentLink18URL: http://sigma.octopart.com:80/reach_statement/Murata-company-16.pdf?src-supplier=Compliance+Statements; ComponentLink18Description: http://sigma.octopart.com:80/reach_statement/Murata-company-16.pdf?src-supplier=Compliance+Statements; Supplier 1: DigiKey; Supplier Part Number 1: 490-1014-1-ND
J?#2 = B2B-PH-K-S: CONN HEADER VERT 2POS 2MM / 2.0mm pitch/Disconnectable Crimp style connectors; Manufacturer: JST; Connector Type: Male Pin; Contact Resistance: 20mΩ; Current Rating: 2A; Dielectric Material: Polyamide; Gender: Male; Insulation Resistance: 1GΩ; Number of Contacts: 2; Pitch: 2.0066mm; Test Voltage: 800V; Supplier: DigiKey; Supplier Part Number: 455-1704-ND; Manufacturer Part Number: B2B-PH-K-S; RoHS: Compliant; Category: Headers and Wire Housings; Pricing: 1=0.11, 10=0.098, 100=0.0829, 500=0.07398, 1000=0.07043, 5000=0.06286, 10000=0.05986 (USD); Color: Natural; Contact Gender: Male; Contact Mating Length: 3.302mm; Contact Plating: Lead, Tin; Export Control Classification Number (ECCN) Code: EAR99; Fastening Type: Detent; Housing Color: Natural; Housing Material: Nylon; Harmonized Tariff Schedule (HTS) Code: 8536.69.40.40; Introduction Date: 1996-12-01; Lead Free: Contains Lead; Lead Pitch: 2mm; Lifecycle Status: Obsolete; Max Operating Temperature: 85°C; Min Operating Temperature: -25°C; Mounting Technology: Through Hole; Pins: 2; Number of Positions: 2; Number of Rows: 1; Orientation: Vertical; Packaging: Bulk; Terminal Pitch: 2mm; Termination: Press-Fit; ComponentLink1URL: https://datasheet.octopart.com:443/B2B-PH-K-S-JST-datasheet-15068535.pdf?src-supplier=IHS; ComponentLink1Description: https://datasheet.octopart.com:443/B2B-PH-K-S-JST-datasheet-15068535.pdf?src-supplier=IHS; ComponentLink2URL: https://datasheet.octopart.com:443/B2B-PH-K-S-JST-datasheet-12510261.pdf?src-supplier=TME; ComponentLink2Description: https://datasheet.octopart.com:443/B2B-PH-K-S-JST-datasheet-12510261.pdf?src-supplier=TME; ComponentLink3URL: https://datasheet.octopart.com:443/B2B-PH-K-S-JST-datasheet-56537.pdf?src-supplier=DigiKey; ComponentLink3Description: https://datasheet.octopart.com:443/B2B-PH-K-S-JST-datasheet-56537.pdf?src-supplier=DigiKey; Supplier 1: DigiKey; Supplier Part Number 1: 455-1704-ND